# Altium schematic sheet v1.0.SchDoc
size 185 x 76 mm
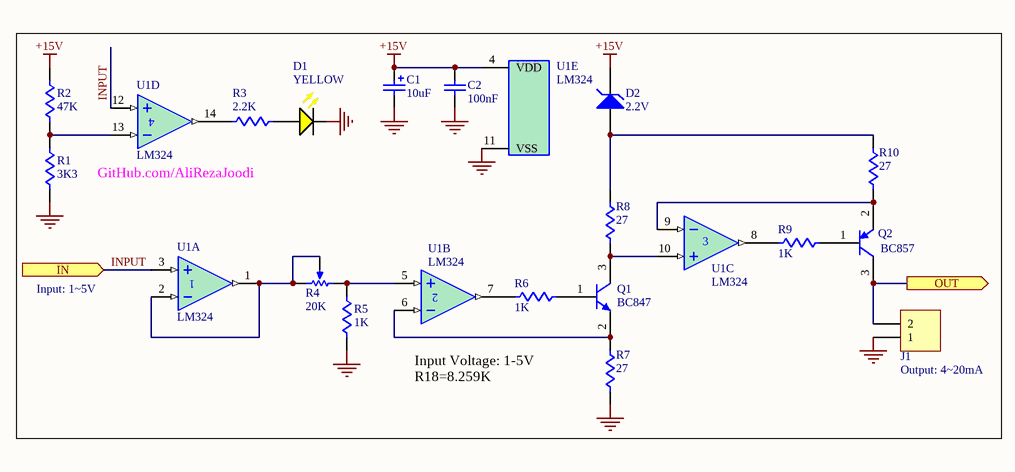
[diagram p0: v1.0.SchDoc]

## Parts
C1  value 10uF  [Cap_B]  (hidden comment: Capacitor)
C2  value 100nF  [0805]  (hidden comment: Cap)
D1  YELLOW  [LED_THD_3MM_YELLOW_R]
D2  value 2.2V  [MELF-D3516-1406]  (hidden comment: LED)
J1  J17  [Fonics_2PIN_1]  (value not drawn)
Q1  value BC847  [SOT23-3N]  (hidden comment: NPN)
Q2  value BC857  [SOT23-3N]  (hidden comment: Q)
R1  3K3  [0805]
R2  value 47K  [0805]  (hidden comment: Res)
R3  value 2.2K  [0805]  (hidden comment: Res)
R4  value 20K  [VR4_]  (hidden comment: RES)
R5  value 1K  [0805]  (hidden comment: RES)
R6  value 1K  [0805]  (hidden comment: RES)
R7  value 27  [0805]  (hidden comment: R59)
R8  value 27  [0805]  (hidden comment: R58)
R9  value 1K  [0805]  (hidden comment: R61)
R10  value 27  [0805]  (hidden comment: R60)
U1  LM324  [DIP_14]  (parts A,B,C,D,E of 5)

## Ports
IN (in), OUT (out)

## Nets
+15V: C1.1 C2.2 D2.2(K) R2.1 U1.4(VDD)
GND: C1.2 C2.1 D1.2(K) J1.1 R1.2 R5.2 R7.1 U1.11(VSS)
INPUT: U1.3(IN+) U1.12(IN+) ; port IN
OUT: J1.2 Q2.3(C) ; port OUT
NetD1_1: D1.1(A) R3.1
NetD2_1: D2.1(A) R8.2 R10.2
NetQ1_1: Q1.1(B) R6.2
NetQ1_2: Q1.2(E) R7.2 U1.6(IN-)
NetQ1_3: Q1.3(C) R8.1 U1.10(IN+)
NetQ2_1: Q2.1(B) R9.2
NetQ2_2: Q2.2(E) R10.1 U1.9(IN-)
NetR1_1: R1.1 R2.2 U1.13(IN-)
NetR3_2: R3.2 U1.14(OUT)
NetR4_1: R4.1(TOP) R5.1 U1.5(IN+)
NetR4_2: R4.2(BOT) R4.3(TAP) U1.1(OUT) U1.2(IN-)
NetR6_1: R6.1 U1.7(OUT)
NetR9_1: R9.1 U1.8(OUT)

## Notes on the sheet
- GitHub.com/AliRezaJoodi
- Input: 1~5V
- Input Voltage: 1-5V
  R18=8.259K
- (near J1) Output: 4~20mA

## Library data of the parts
C1 = Cap Pol1: Polarized Capacitor (Radial); Manufacturer: Generic Components; Class I: Passive; Published: 8-Jun-2000; Revision: July-2002: Re-released for DXP Platform.; Publisher: Altium Limited; Class II: Capacitor
C2 = Cap: Capacitor; Manufacturer: Generic Components; Class I: Passive; Published: 8-Jun-2000; Revision: July-2002: Re-released for DXP Platform.; Publisher: Altium Limited; Class II: Capacitor
D1 = LED_YELLOW: LED, Yellow; Manufacturer: Generic Components; Class I: Optoelectronic; Published: 8-Jun-2000; Revision: July-2002: Re-released for DXP Platform.; Publisher: Altium Limited; Class II: LED
D2 = D Zener: Zener Diode; Manufacturer: Generic Components; Class I: Discrete; Class II: Diode - Zener; Published: 8-Jun-2000; Revision: July-2002: Re-released for DXP Platform.; Publisher: Altium Limited
J1 = Header 2: Header, 2-Pin; LatestRevisionDate: 17-Jul-2002; LatestRevisionNote: Re-released for DXP Platform.; Publisher: Altium Limited
Q1 = BC847: Silicon Bipolar Transistor
Q2 = BC857: Silicon Bipolar Transistor
R1-R3 R5-R10 = Res1: Resistor; Manufacturer: Generic Components; Class I: Passive; Published: 8-Jun-2000; Revision: July-2002: Re-released for DXP Platform.; Publisher: Altium Limited; Class II: Resistor
R4 = RPot1: Potentiometer; Manufacturer: Generic Components; Class I: Passive; Set Position: 0.5; Published: 8-Jun-2000; Revision: July-2002: Re-released for DXP Platform.; Publisher: Altium Limited; Class II: Potentiometer
U1 = LM324: Quad Low-Power Operational Amplifier; Published: 17-Jul-2002; LatestRevisionDate: 06-Jun-2005; LatestRevisionNote: Stylized 3D Model Added.; DatasheetVersion: 1988; PackageVersion: 1997; PackageReference: 646-06; Publisher: Altium Limited; PackageDescription: DIP; 14 Leads; Row Spacing 7.62 mm; Pitch 2.54 mm; ComponentLink1Description: Manufacturer Link; ComponentLink1URL: http://www.onsemi.com/site/products/parametrics/0,4446,251,00.html; ComponentLink2Description: Datasheet; ComponentLink2URL: http://www.onsemi.com/pub/Collateral/LM324-D.PDF